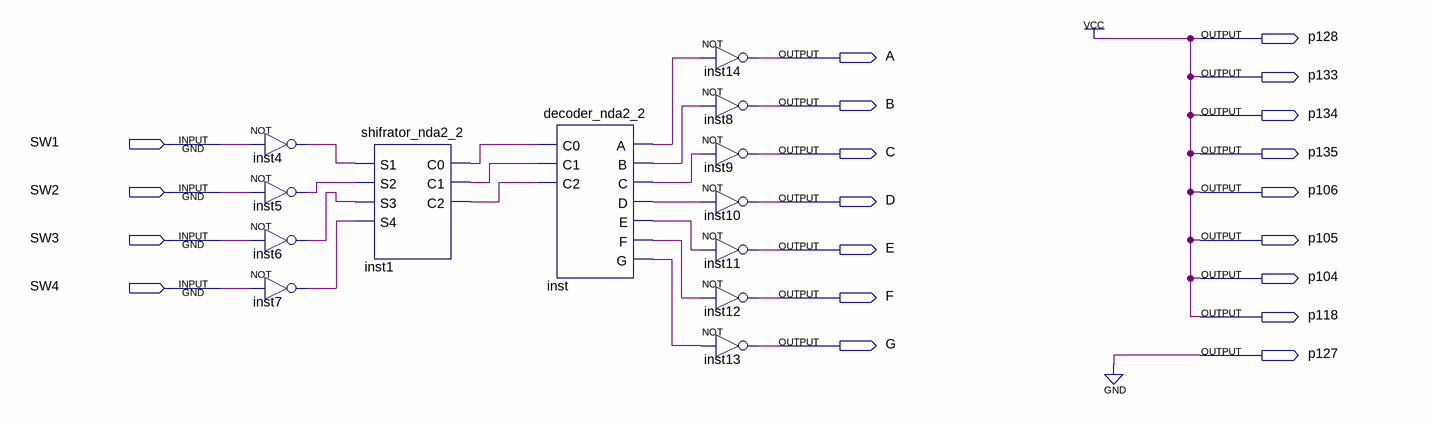
[diagram p0: schematic sheet]
// Quartus schematic coder_stand_nda2_2.bdf as structural Verilog: 13 symbols, 20 pins
module coder_stand_nda2_2 (
  input  SW1,
  input  SW2,
  input  SW3,
  input  SW4,
  output p128,
  output A,
  output p133,
  output B,
  output p134,
  output C,
  output p135,
  output p106,
  output D,
  output p105,
  output E,
  output p104,
  output F,
  output p118,
  output G,
  output p127
);

  wire inst1_c0, inst1_c1, inst1_c2, inst4_out, inst5_out, inst6_out, inst7_out, inst_a, inst_b, inst_c,
       inst_d, inst_e, inst_f, inst_g;

  not inst4 (inst4_out, SW1);
  not inst5 (inst5_out, SW2);
  not inst6 (inst6_out, SW3);
  not inst7 (inst7_out, SW4);
  shifrator_nda2_2 inst1 (
    .S1(inst4_out), .S2(inst5_out), .S3(inst6_out), .S4(inst7_out), .C0(inst1_c0), .C1(inst1_c1),
    .C2(inst1_c2));
  decoder_nda2_2 inst (
    .C0(inst1_c0), .C1(inst1_c1), .C2(inst1_c2), .A(inst_a), .B(inst_b), .C(inst_c), .D(inst_d), .E(inst_e),
    .F(inst_f), .G(inst_g));
  not inst14 (A, inst_a);
  not inst8 (B, inst_b);
  not inst9 (C, inst_c);
  not inst10 (D, inst_d);
  not inst11 (E, inst_e);
  not inst12 (F, inst_f);
  not inst13 (G, inst_g);

  assign p104 = 1'b1;
  assign p105 = 1'b1;
  assign p106 = 1'b1;
  assign p118 = 1'b1;
  assign p127 = 1'b0;
  assign p128 = 1'b1;
  assign p133 = 1'b1;
  assign p134 = 1'b1;
  assign p135 = 1'b1;
endmodule
